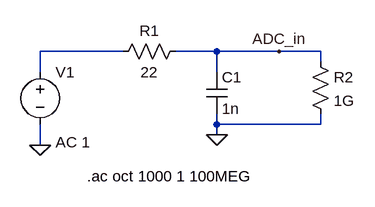
[diagram p0: schematic antialiasing_filter.asc]
antialiasing_filter.asc, the LTspice schematic file:
Version 4
SHEET 1 880 680
WIRE 32 144 -96 144
WIRE 176 144 112 144
WIRE 272 144 176 144
WIRE 336 144 272 144
WIRE 336 160 336 144
WIRE -96 176 -96 144
WIRE 176 176 176 144
WIRE 176 256 176 240
WIRE 336 256 336 240
WIRE 336 256 176 256
WIRE 176 272 176 256
WIRE -96 288 -96 256
FLAG 176 272 0
FLAG -96 288 0
FLAG 272 144 ADC_in
SYMBOL cap 160 176 R0
SYMATTR InstName C1
SYMATTR Value 1n
SYMBOL res 128 128 R90
WINDOW 0 0 56 VBottom 2
WINDOW 3 32 56 VTop 2
SYMATTR InstName R1
SYMATTR Value 22
SYMBOL res 320 144 R0
SYMATTR InstName R2
SYMATTR Value 1G
SYMBOL voltage -96 160 R0
WINDOW 123 24 124 Left 2
WINDOW 39 0 0 Left 2
SYMATTR Value2 AC 1
SYMATTR InstName V1
SYMATTR Value ""
TEXT -24 336 Left 2 !.ac oct 1000 1 100MEG

The netlist it stands for:
* antialiasing_filter.asc
C1 ADC_in 0 1n
R1 ADC_in N001 22
R2 ADC_in 0 1G
V1 N001 0 AC 1
.ac oct 1000 1 100MEG
.backanno
.end